# EAGLE schematic adc module (EAGLE 6.5.0)
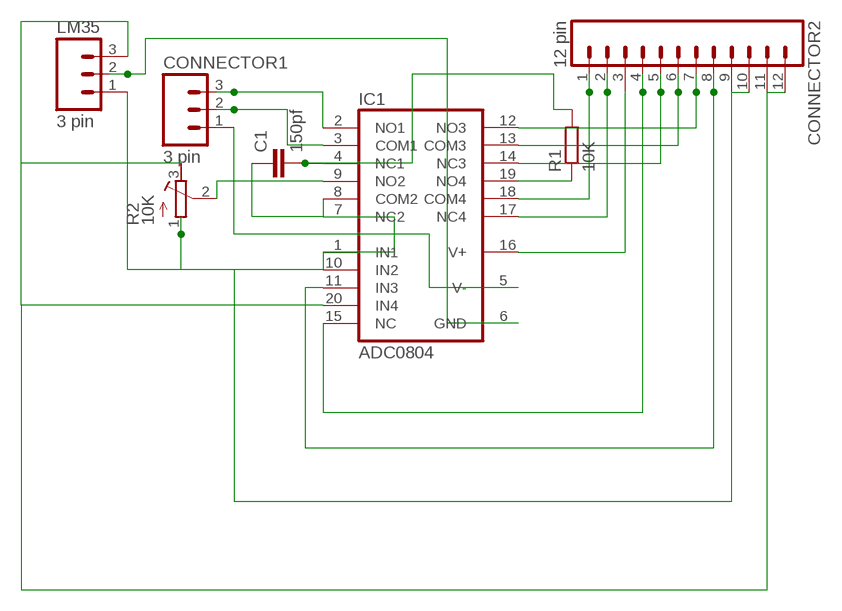
[diagram p0: schematic, sheet 1]

## Parts
C1  150pf  C2.5/4  [C2.5-4]
CONNECTOR1  3 pin  M03  [03P]
CONNECTOR2  12 pin  M12  [12P]
IC1  ADC0804  MAX333ACPP  [DIL20]
LM35  3 pin  M03  [03P]
R1  10K  R-EU_0204/7  [0204/7]
R2  10K  R-TRIMM74W  [RTRIM74W]

## Nets
N$1: CONNECTOR2.1 IC1.18(COM4)
N$2: CONNECTOR2.2 IC1.17(NC4)
N$3: CONNECTOR2.3 IC1.16(V+)
N$4: CONNECTOR2.4 IC1.15(NC)
N$5: CONNECTOR2.5 IC1.14(NC3)
N$6: CONNECTOR2.6 IC1.13(COM3)
N$7: CONNECTOR2.7 IC1.12(NO3)
N$8: CONNECTOR2.8 IC1.11(IN3)
N$9: IC1.19(NO4) R1.1
N$10: C1.2 IC1.4(NC1) R1.2
N$11: CONNECTOR1.3 IC1.2(NO1)
N$12: CONNECTOR1.2 IC1.3(COM1)
N$13: CONNECTOR1.1 IC1.5(V-)
N$15: C1.1 CONNECTOR2.9 CONNECTOR2.10 IC1.1(IN1) IC1.7(NC2) IC1.8(COM2) IC1.10(IN2) LM35.1 R2.1(A)
N$16: IC1.6(GND) LM35.2
N$17: IC1.9(NO2) R2.2(S)
N$18: CONNECTOR2.11 CONNECTOR2.12 IC1.20(IN4) LM35.3 R2.3(E)

## Library data of the parts
C1 = capacitor-wima:C: CAPACITOR naming: grid - package width
CONNECTOR1 LM35 = con-amp-quick:M03: AMP QUICK CONNECTOR; OC_FARNELL: unknown; OC_NEWARK: unknown
CONNECTOR2 = con-amp-quick:M12: AMP QUICK CONNECTOR; OC_FARNELL: unknown; OC_NEWARK: unknown
IC1 = maxim:MAX333ACPP: ANALOG SWITCH; MF: MAXIM; MPN: MAX333ACPP; OC_FARNELL: unknown; OC_NEWARK: 77C9354
R1 = rcl:R-EU_: RESISTOR, European symbol
R2 = rcl:R-TRIMM: Trimm resistor